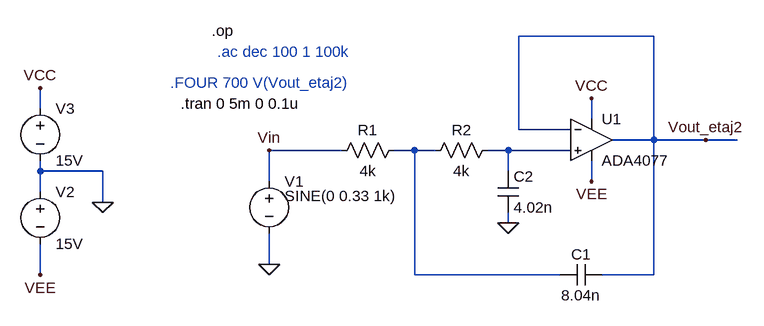
[diagram p0: schematic Sallen Key.asc]
Sallen Key.asc, the LTspice schematic file:
Version 4
SHEET 1 1180 680
WIRE 1024 80 816 80
WIRE 80 192 80 160
WIRE 928 208 928 176
WIRE 816 224 816 80
WIRE 896 224 816 224
WIRE 1024 240 1024 80
WIRE 1024 240 960 240
WIRE 1104 240 1024 240
WIRE 1152 240 1104 240
WIRE 544 256 432 256
WIRE 656 256 624 256
WIRE 688 256 656 256
WIRE 800 256 768 256
WIRE 896 256 800 256
WIRE 80 288 80 272
WIRE 176 288 80 288
WIRE 800 288 800 256
WIRE 432 304 432 256
WIRE 928 304 928 272
WIRE 80 320 80 288
WIRE 176 336 176 288
WIRE 800 368 800 352
WIRE 432 432 432 384
WIRE 80 448 80 400
WIRE 656 448 656 256
WIRE 880 448 656 448
WIRE 1024 448 1024 240
WIRE 1024 448 944 448
FLAG 928 304 VEE
FLAG 928 176 VCC
FLAG 432 432 0
FLAG 1104 240 Vout_etaj2
FLAG 800 368 0
FLAG 176 336 0
FLAG 80 160 VCC
FLAG 80 448 VEE
FLAG 432 256 Vin
SYMBOL voltage 432 288 R0
WINDOW 39 0 0 Left 2
WINDOW 3 24 38 Left 2
SYMATTR Value SINE(0 0.33 1k)
SYMATTR Value2 AC 1
SYMATTR InstName V1
SYMBOL res 640 240 R90
WINDOW 0 0 56 VBottom 2
WINDOW 3 32 56 VTop 2
SYMATTR InstName R1
SYMATTR Value 4k
SYMBOL res 784 240 R90
WINDOW 0 0 56 VBottom 2
WINDOW 3 32 56 VTop 2
SYMATTR InstName R2
SYMATTR Value 4k
SYMBOL cap 784 288 R0
SYMATTR InstName C2
SYMATTR Value 4.02n
SYMBOL cap 944 432 R90
WINDOW 0 0 32 VBottom 2
WINDOW 3 32 32 VTop 2
SYMATTR InstName C1
SYMATTR Value 8.04n
SYMBOL Opamps/ADA4077 928 176 R0
SYMATTR InstName U1
SYMBOL Voltage 80 304 R0
SYMATTR InstName V2
SYMATTR Value 15V
SYMBOL Voltage 80 176 R0
SYMATTR InstName V3
SYMATTR Value 15V
TEXT 344 72 Left 2 !.op
TEXT 352 104 Left 2 ;.ac dec 100 1 100k
TEXT 280 152 Left 2 ;.FOUR 700 V(Vout_etaj2)
TEXT 296 184 Left 2 !.tran 0 5m 0 0.1u

The netlist it stands for:
* Sallen Key.asc
V1 Vin 0 SINE(0 0.33 1k) AC 1
R1 N001 Vin 4k
R2 N002 N001 4k
C2 N002 0 4.02n
C1 Vout_etaj2 N001 8.04n
XU1 N002 Vout_etaj2 VCC VEE Vout_etaj2 ADA4077  ; pins In+ In- V+ V- OUT
V2 0 VEE 15V
V3 VCC 0 15V
.op
* .ac dec 100 1 100k
* .FOUR 700 V(Vout_etaj2)
.tran 0 5m 0 0.1u
.backanno
.end